# Altium project BC2087.PrjPcb (part 2 of 5)

## Sheet RJ45.SchDoc: =project_title
size Tabloid; CompanyName: Luxonis Holding; DrawnBy: Boris Chou / Blaz Kvas; Organization: Luxonis Holding; Address1: 1925 Harmony Park Drive; Address2: Westminster, CO; Address3: 80234; Address4: United States; DocumentNumber: D2088000; Revision: R3M1E3; SheetNumber: 8; SheetTotal: 12
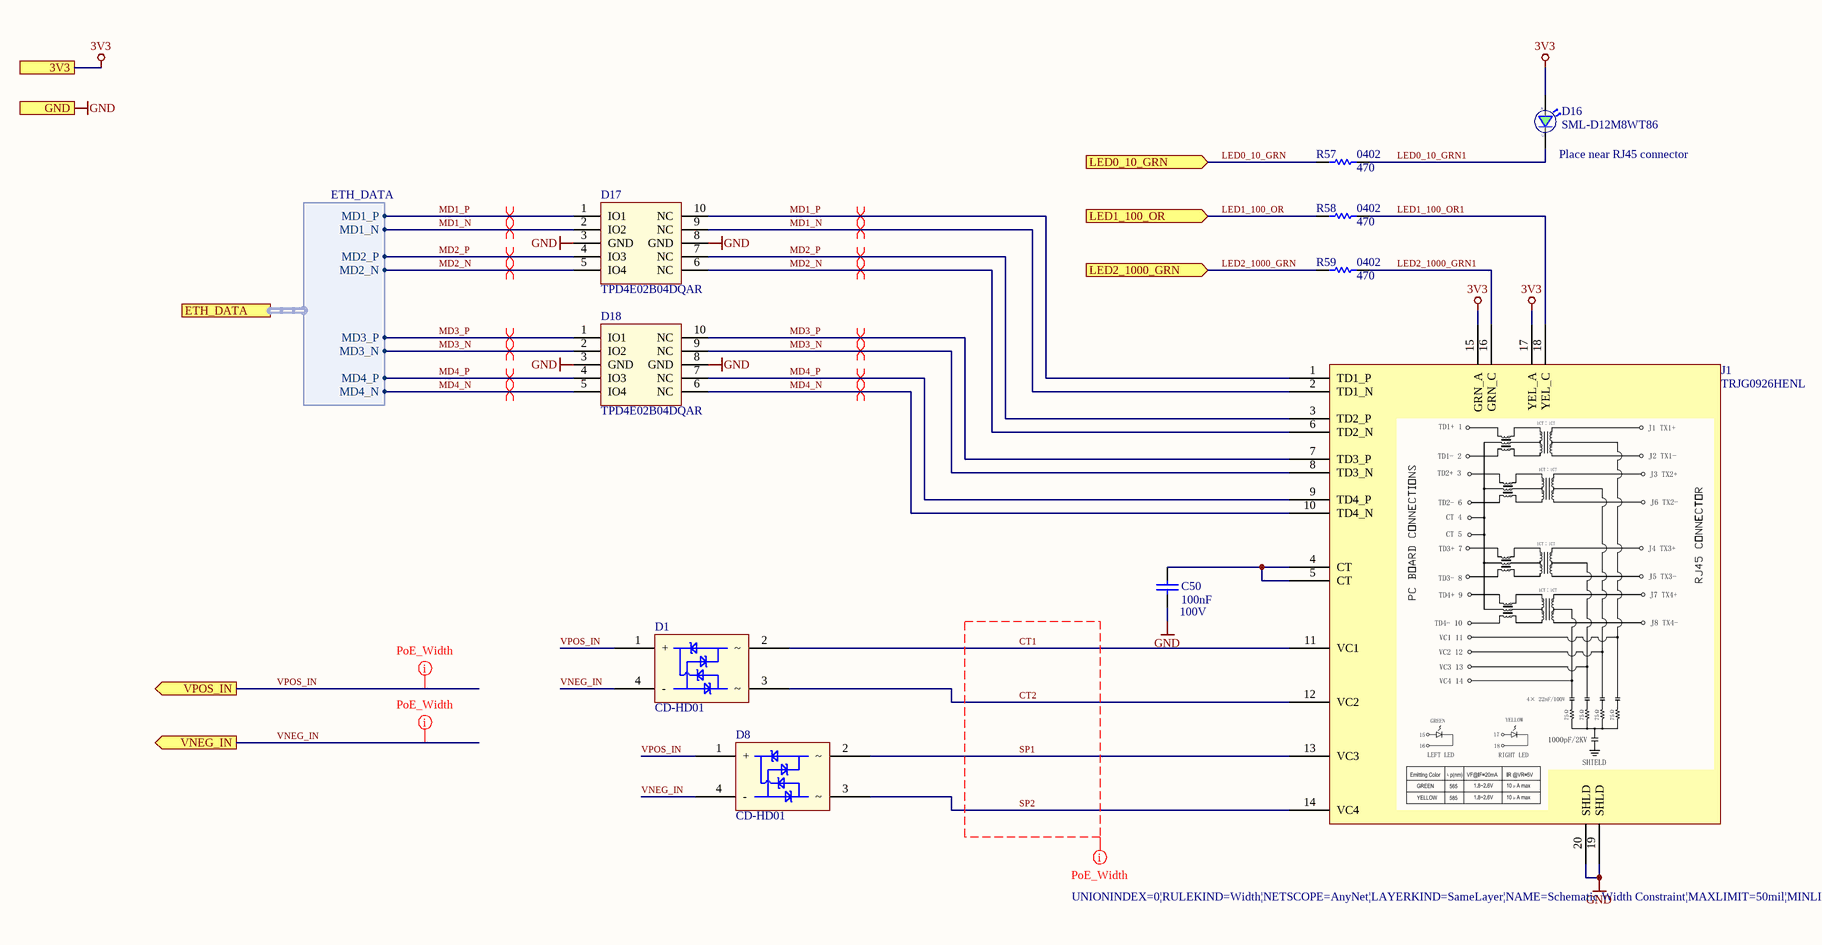
[diagram p5: RJ45.SchDoc]

### Parts
C50  value 100nF  Voltage Rating: 100V  [CAPC0805(2012)145_N]  (hidden comment: CL21B104KCFNNNE)
D1  CD-HD01  [CD-H01]
D8  CD-HD01  [CD-H01]
D16  SML-D12M8WT86  [SML_D1xx8W]
D17  TPD4E02B04DQAR  [TPD4E02B04DQAR]
D18  TPD4E02B04DQAR  [TPD4E02B04DQAR]
J1  TRJG0926HENL  [TRJG0926HENL]
R57  value 470  Case/Package: 0402  [RESC0402(1005)_N]  (hidden comment: CRCW0402470RFKED)
R58  value 470  Case/Package: 0402  [RESC0402(1005)_N]  (hidden comment: CRCW0402470RFKED)
R59  value 470  Case/Package: 0402  [RESC0402(1005)_N]  (hidden comment: CRCW0402470RFKED)

### Ports
3V3, ETH_DATA (harness ETH_DATA), GND, LED0_10_GRN (in), LED1_100_OR (in), LED2_1000_GRN (in), VNEG_IN (out), VPOS_IN (out)

### Harnesses
ETH_DATA: MD1_P, MD1_N, MD2_P, MD2_N, MD3_P, MD3_N, MD4_P, MD4_N

### Nets
3V3: D16.2(A) J1.15(GRN_A) J1.17(YEL_A) ; port 3V3
GND: C50.1 D17.3(GND) D17.8(GND) D18.3(GND) D18.8(GND) J1.19(SHLD) J1.20(SHLD) ; port GND
VNEG_IN: D1.4(-) D8.4(-) ; port VNEG_IN
CT1: D1.2 J1.11(VC1)
CT2: D1.3 J1.12(VC2)
LED0_10_GRN: R57.1 ; port LED0_10_GRN
LED0_10_GRN1: D16.1(C) R57.2
LED1_100_OR: R58.1 ; port LED1_100_OR
LED1_100_OR1: J1.18(YEL_C) R58.2
LED2_1000_GRN: R59.1 ; port LED2_1000_GRN
LED2_1000_GRN1: J1.16(GRN_C) R59.2
MD1_N: D17.2(IO2) D17.9(NC) J1.2(TD1_N) ; port ETH_DATA.MD1_N
MD1_P: D17.1(IO1) D17.10(NC) J1.1(TD1_P) ; port ETH_DATA.MD1_P
MD2_N: D17.5(IO4) D17.6(NC) J1.6(TD2_N) ; port ETH_DATA.MD2_N
MD2_P: D17.4(IO3) D17.7(NC) J1.3(TD2_P) ; port ETH_DATA.MD2_P
MD3_N: D18.2(IO2) D18.9(NC) J1.8(TD3_N) ; port ETH_DATA.MD3_N
MD3_P: D18.1(IO1) D18.10(NC) J1.7(TD3_P) ; port ETH_DATA.MD3_P
MD4_N: D18.5(IO4) D18.6(NC) J1.10(TD4_N) ; port ETH_DATA.MD4_N
MD4_P: D18.4(IO3) D18.7(NC) J1.9(TD4_P) ; port ETH_DATA.MD4_P
SP1: D8.2 J1.13(VC3)
SP2: D8.3 J1.14(VC4)
VPOS_IN: D1.1(+) D8.1(+) ; port VPOS_IN
NetC50_2: C50.2 J1.4(CT) J1.5(CT)

### Layout directives
differential pair; net class ETH; differential pair class 100ohm: MD1_N, MD1_P, MD2_N, MD2_P, MD3_N, MD3_P, MD4_N, MD4_P
rule Width Constraint [Pref Width = 15mil    Min Width = 4mil    Max Width = 50mil]; net class PoE: CT1, CT2, SP1, SP2, VNEG_IN, VPOS_IN

### Notes on the sheet
- (near D16) Place near RJ45 connector
- Title
- Size:
- Date:
- Tabloid
- Number:
- Time:
- Revision:
- Sheet
- of
- Drawn by:

### Library data of the parts
C50 = CMP-108-000003-5: CAP CER 0.1UF 100V X7R 0805 10%; Manufacturer 1: Samsung; Manufacturer Part Number 1: CL21B104KCFNNNE; Case/Package: 0805; Min Operating Temperature: -55°C; Max Operating Temperature: 125°C; Tolerance: 10%; Dielectric: X7R; Length: 2mm; Width: 0.049inch; Depth: 1.25mm; ComponentLink1URL: https://datasheet.ciiva.com/26936/getdatasheetpartid-781823-26936904.pdf?src-supplier=Verical; ComponentLink1Description: https://datasheet.ciiva.com/26936/getdatasheetpartid-781823-26936904.pdf?src-supplier=Verical; Design Item ID: CL21B104KCFNNNE; Mounting Technology: SMT
D1 D8 = CMP-004-00050-1: CD-HD0x Series Schottky Bridge Rectifier Diode 100V 4-Pin Surface Mount T/R; Manufacturer 1: Bourns; Average Rectified Current: 1A; RoHS: No; Stock 1: 15383; Pricing 1: 1=0.61000, 10=0.52500, 100=0.36400, 500=0.28420, 1000=0.23100, 2000=0.21700 (USD); Mount: Surface Mount; Min Operating Temperature: -55°C; Max Operating Temperature: 125°C; Packaging: Tape and Reel; Manufacturer Part Number 1: CD-HD01; Design Item ID: CD-HD01; Source: NG9097_test.SchLib
D16 = CMP-111-000004-2: LED GREEN DIFFUSED 0603 SMD Green 572nm LED Indication - Discrete 2.2V 0603 (1608 Metric); Manufacturer 1: Rohm; Forward Current: 20mA; Color: Green,Yellow; Case/Package: 0603; Min Operating Temperature: -40°C; Max Operating Temperature: 85°C; Forward Voltage: 2.2V; Manufacturer Part Number 1: SML-D12M8WT86
D17 D18 = CMP-111-000006-2: TVS DIODE 3.6V 8.8V 10USON 8.8V (Typ) Clamp 5A (8/20µs) Ipp Tvs Diode Surface Mount 10-USON (2.5x1); Manufacturer 1: Texas Instruments; Number of Bidirectional Channels: 4; Min Breakdown Voltage: 5.5V; Peak Pulse Power: 17W; Power Line Protection: No; Interface: USB,HDMI; Manufacturer Part Number 1: TPD4E02B04DQAR; Stock 1: 25615; Pricing 1: 1=0.69000, 10=0.60800, 100=0.46650, 500=0.36874, 1000=0.29499 (USD); RoHS: Yes; Mount: Surface Mount; Number of Pins: 10; Min Operating Temperature: -40°C; Max Operating Temperature: 125°C; Packaging: Cut Tape; Reverse Standoff Voltage: 3.6V; Clamping Voltage: 8.8V; Operating Supply Voltage: 3.6V; Peak Pulse Current: 5A; Number of Channels: 4; Composition: Zener; REACH SVHC: No SVHC; Lead Free: Lead Free; ComponentLink1URL: http://www.ti.com/general/docs/lit/getliterature.tsp?genericPartNumber=TPD4E02B04&amp;&amp;fileType=pdf&src-supplier=Element14; ComponentLink1Description: http://www.ti.com/general/docs/lit/getliterature.tsp?genericPartNumber=TPD4E02B04&amp;&amp;fileType=pdf&src-supplier=Element14; ComponentLink2URL: http://www.ti.com/lit/ds/symlink/tpd4e02b04.pdf?src-supplier=Farnell; ComponentLink2Description: http://www.ti.com/lit/ds/symlink/tpd4e02b04.pdf?src-supplier=Farnell; ComponentLink3URL: http://www.ti.com/lit/ds/symlink/tpd4e02b04.pdf?src-supplier=Newark; ComponentLink3Description: http://www.ti.com/lit/ds/symlink/tpd4e02b04.pdf?src-supplier=Newark; ComponentLink4URL: http://www.ti.com/lit/ds/symlink/tpd4e02b04.pdf?src-supplier=Digi-Key; ComponentLink4Description: http://www.ti.com/lit/ds/symlink/tpd4e02b04.pdf?src-supplier=Digi-Key; Design Item ID: TPD4E02B04DQAR; Source: BW2098POE_1.SCHLIB
J1 = CMP-109-000002-2: CONN MAGJACK 1PORT 1000 BASET; Manufacturer 1: Trxcom; System: Connector; Manufacturer Part Number 1: TRJG0926HENL; Design Item ID: TRJG0926HENL; Pins: 18; Source: BW2098POE_1.SCHLIB
R57-R59 = CMP-013-000029-9: RES SMD 470 OHM 1% 1/16W 0402; Manufacturer 1: Vishay; Power Rating: 63mW; Voltage Rating: 50V; Manufacturer Part Number 1: CRCW0402470RFKED; Min Operating Temperature: -55°C; Max Operating Temperature: 155°C; Tolerance: 1%; Design Item ID: CRCW0402470RFKED

## Sheet USB.SchDoc: =project_title
size Tabloid; PageSetup: Record=PageOptions|CenterHorizontal=True|CenterVertical=True|PrintScale=0.73|XCorrection=1.00|YCorrection=1.00|PrintKind=0|BorderSize=5000000|LeftOffset=0|BottomOffset=0|Orientation=2|PaperLength=1000|PaperWidth=1000|Scale=100|PaperSource=7|PrintQuality=-4|MediaType=1|DitherType=10|PaperKind=A4|PrintScaleMode=1; CompanyName: Luxonis Holding; DrawnBy: Boris Chou / Blaz Kvas; Organization: Luxonis Holding; Address1: 1925 Harmony Park Drive; Address2: Westminster, CO; Address3: 80234; Address4: United States; DocumentNumber: D2088000; Revision: R3M1E3; SheetNumber: 11; SheetTotal: 12
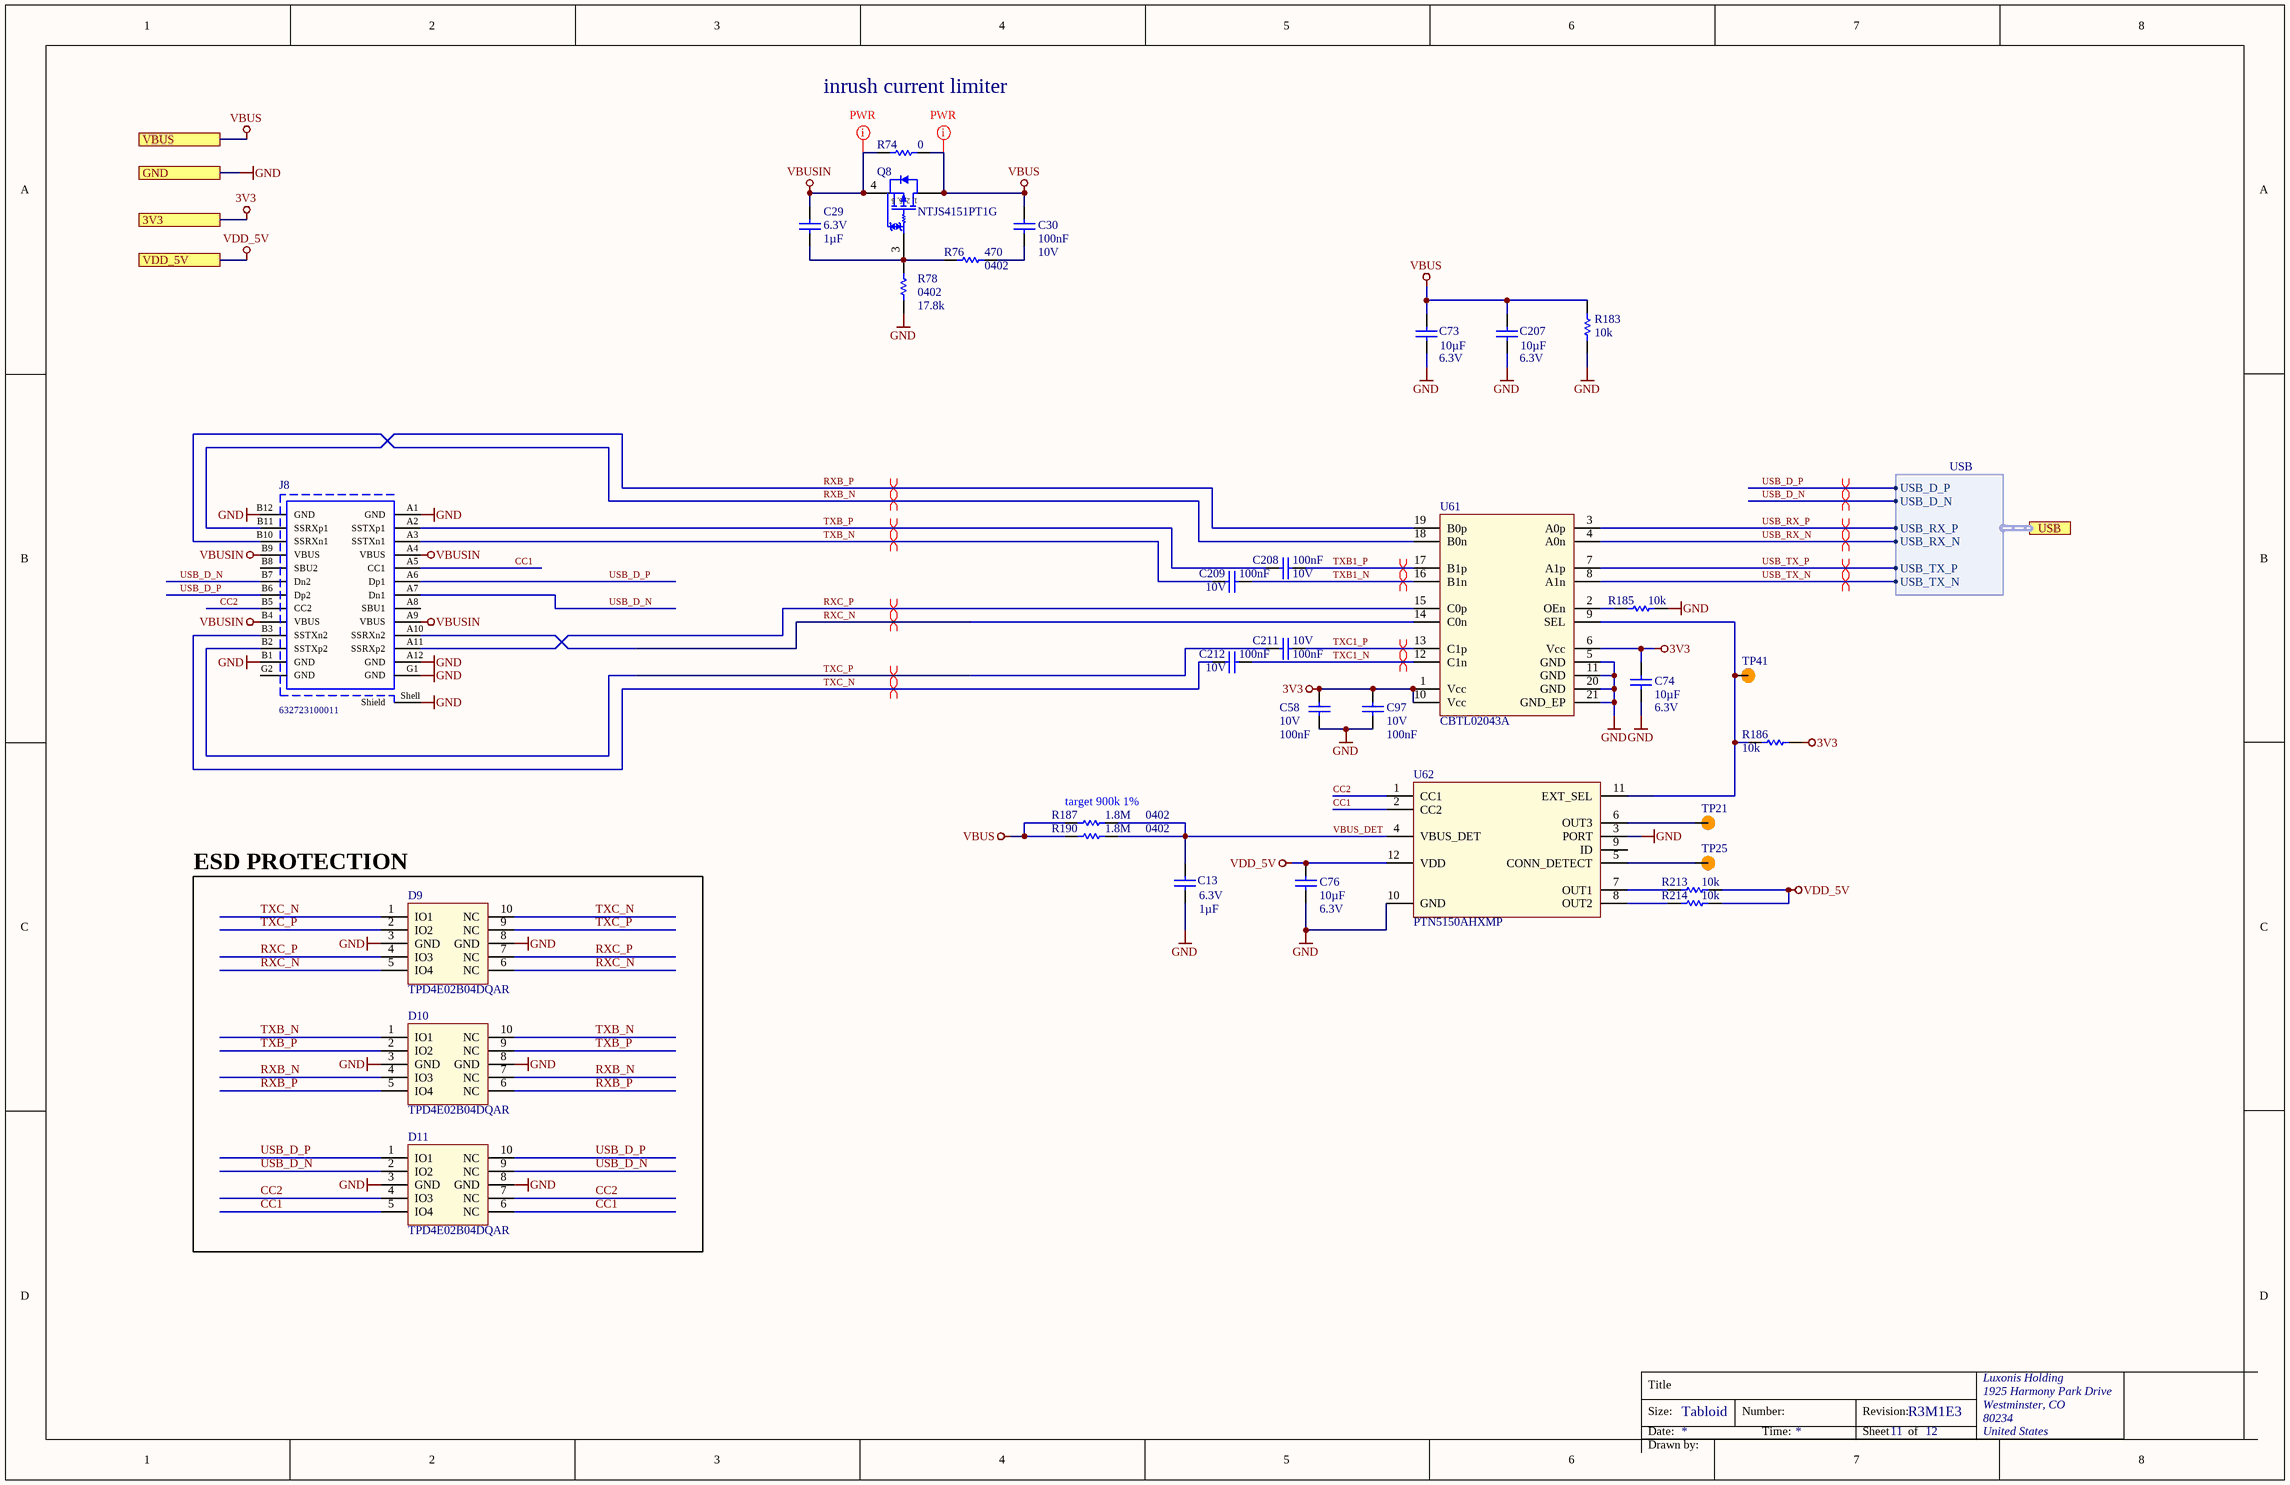
[diagram p6: USB.SchDoc]

### Parts
C13  value 1µF  Voltage Rating: 6.3V  [CAPC0201(0603)33_L]  (hidden comment: GRM033R60J105MEA2D)
C29  value 1µF  Voltage Rating: 6.3V  [CAPC0201(0603)33_L]  (hidden comment: GRM033R60J105MEA2D)
C30  value 100nF  Voltage Rating: 10V  [CAPC0201(0603)33_L]  (hidden comment: GRM033R61A104KE15D)
C58  value 100nF  Voltage Rating: 10V  [CAPC0201(0603)33_L]  (hidden comment: GRM033R61A104KE15D)
C73  value 10µF  Voltage Rating: 6.3V  [CAPC0402(1005)70_N]  (hidden comment: GRM155R60J106ME15D)
C74  value 10µF  Voltage Rating: 6.3V  [CAPC0402(1005)70_N]  (hidden comment: GRM155R60J106ME15D)
C76  value 10µF  Voltage Rating: 6.3V  [CAPC0402(1005)70_N]  (hidden comment: GRM155R60J106ME15D)
C97  value 100nF  Voltage Rating: 10V  [CAPC0201(0603)33_L]  (hidden comment: GRM033R61A104KE15D)
C207  value 10µF  Voltage Rating: 6.3V  [CAPC0402(1005)70_N]  (hidden comment: GRM155R60J106ME15D)
C208  value 100nF  Voltage Rating: 10V  [CAPC0201(0603)33_L]  (hidden comment: GRM033R61A104KE15D)
C209  value 100nF  Voltage Rating: 10V  [CAPC0201(0603)33_L]  (hidden comment: GRM033R61A104KE15D)
C211  value 100nF  Voltage Rating: 10V  [CAPC0201(0603)33_L]  (hidden comment: GRM033R61A104KE15D)
C212  value 100nF  Voltage Rating: 10V  [CAPC0201(0603)33_L]  (hidden comment: GRM033R61A104KE15D)
D9  TPD4E02B04DQAR  [TPD4E02B04DQAR]
D10  TPD4E02B04DQAR  [TPD4E02B04DQAR]
D11  TPD4E02B04DQAR  [TPD4E02B04DQAR]
J8  632723100011  [632723100011]
Q8  NTJS4151PT1G  [ONSC-SC70-6-419B-02_W_V]
R74  value 0  [RESC0603(1608)_L]  (hidden comment: CRCW06030000Z0EA)
R76  value 470  Case/Package: 0402  [RESC0402(1005)_L]  (hidden comment: CRCW0402470RFKED)
R78  value 17.8k  Case/Package: 0402  [RESC0402(1005)_L]  (hidden comment: ERJ-2RKF1782X)
R183  value 10k  [RESC0402(1005)_N]  (hidden comment: RC0402FR-1310KL)
R185  value 10k  [RESC0402(1005)_N]  (hidden comment: RC0402FR-1310KL)
R186  value 10k  [RESC0402(1005)_N]  (hidden comment: RC0402FR-1310KL)
R187  value 1.8M  Case/Package: 0402  [RESC0402(1005)_N]  (hidden comment: CRCW04021M80FKED)
R190  value 1.8M  Case/Package: 0402  [RESC0402(1005)_N]  (hidden comment: CRCW04021M80FKED)
R213  value 10k  [RESC0402(1005)_N]  (hidden comment: RC0402FR-1310KL)
R214  value 10k  [RESC0402(1005)_N]  (hidden comment: RC0402FR-1310KL)
TP21  TEST_POINT  [TP075_150_NS]  (value not drawn)  (no BOM)
TP25  TEST_POINT  [TP075_150_NS]  (value not drawn)  (no BOM)
TP41  TEST_POINT  [TP075_150_NS]  (value not drawn)  (no BOM)
U61  CBTL02043A  [CBTL02043A]
U62  PTN5150AHXMP  [PTN5150H]

### Blocks framed on the sheet
ESD PROTECTION: D9-D11

### Ports
3V3, GND, USB (harness USB), VBUS, VDD_5V

### Harnesses
USB: USB_D_P, USB_D_N, USB_TX_N, USB_TX_P, USB_RX_N, USB_RX_P

### Nets
3V3: C58.2 C74.2 C97.2 R186.2 U61.1(Vcc) U61.6(Vcc) U61.10(Vcc) ; port 3V3
GND: C13.1 C58.1 C73.1 C74.1 C76.1 C97.1 C207.1 D9.3(GND) D9.8(GND) D10.3(GND) D10.8(GND) D11.3(GND) D11.8(GND) J8.A1(GND) J8.A12(GND) J8.B1(GND) J8.B12(GND) J8.G1(GND) J8.Shell(Shield) R78.1 R183.1 R185.2 U61.5(GND) U61.11(GND) U61.20(GND) U61.21(GND_EP) U62.3(PORT) U62.10(GND) ; port GND
VBUS: C30.2 C73.2 C207.2 Q8.1(D) Q8.2(D) Q8.5(D) Q8.6(D) R74.2 R183.2 R187.1 R190.1 ; port VBUS
VBUSIN: C29.2 J8.A4(VBUS) J8.A9(VBUS) J8.B4(VBUS) J8.B9(VBUS) Q8.4(S) R74.1
VDD_5V: C76.2 R213.2 R214.2 U62.12(VDD) ; port VDD_5V
CC1: D11.5(IO4) D11.6(NC) J8.A5(CC1) U62.2(CC2)
CC2: D11.4(IO3) D11.7(NC) J8.B5(CC2) U62.1(CC1)
RXB_N: D10.4(IO3) D10.7(NC) J8.B10(SSRXn1) U61.18(B0n)
RXB_P: D10.5(IO4) D10.6(NC) J8.B11(SSRXp1) U61.19(B0p)
RXC_N: D9.5(IO4) D9.6(NC) J8.A10(SSRXn2) U61.14(C0n)
RXC_P: D9.4(IO3) D9.7(NC) J8.A11(SSRXp2) U61.15(C0p)
TXB1_N: C209.2 U61.16(B1n)
TXB1_P: C208.2 U61.17(B1p)
TXB_N: C209.1 D10.1(IO1) D10.10(NC) J8.A3(SSTXn1)
TXB_P: C208.1 D10.2(IO2) D10.9(NC) J8.A2(SSTXp1)
TXC1_N: C212.2 U61.12(C1n)
TXC1_P: C211.2 U61.13(C1p)
TXC_N: C212.1 D9.1(IO1) D9.10(NC) J8.B3(SSTXn2)
TXC_P: C211.1 D9.2(IO2) D9.9(NC) J8.B2(SSTXp2)
USB_D_N: D11.2(IO2) D11.9(NC) J8.A7(Dn1) J8.B7(Dn2) ; port USB.USB_D_N
USB_D_P: D11.1(IO1) D11.10(NC) J8.A6(Dp1) J8.B6(Dp2) ; port USB.USB_D_P
USB_RX_N: U61.4(A0n) ; port USB.USB_RX_N
USB_RX_P: U61.3(A0p) ; port USB.USB_RX_P
USB_TX_N: U61.8(A1n) ; port USB.USB_TX_N
USB_TX_P: U61.7(A1p) ; port USB.USB_TX_P
VBUS_DET: C13.2 R187.2 R190.2 U62.4(VBUS_DET)
NetC29_1: C29.1 Q8.3(G) R76.1 R78.2
NetC30_1: C30.1 R76.2
NetR185_1: R185.1 U61.2(OEn)
NetR186_1: R186.1 TP41.1 U61.9(SEL) U62.11(EXT_SEL)
NetR213_1: R213.1 U62.7(OUT1)
NetR214_1: R214.1 U62.8(OUT2)
NetTP21_1: TP21.1 U62.6(OUT3)
NetTP25_1: TP25.1 U62.5(CONN_DETECT)

Not connected (* = marked no-connect by the designer): J8 A8(SBU1) B8(SBU2) G2(GND); U62 9(ID)

### Layout directives
differential pair; differential pair class USB3: RXB_N, RXB_P, RXC_N, RXC_P, TXB1_N, TXB1_P, TXB_N, TXB_P, TXC1_N, TXC1_P, TXC_N, TXC_P, USB_D_N, USB_D_P, USB_RX_N, USB_RX_P, USB_TX_N, USB_TX_P
net class Power_trace: VBUS, VBUSIN

### Notes on the sheet
- inrush current limiter
- (near R187) target 900k 1%
- Title
- Size:
- Date:
- Tabloid
- Number:
- Time:
- Revision:
- Sheet
- of
- Drawn by:
- (in symbol CMP-061-000004-2) 1, 2, 5, 6

### Library data of the parts
C13 C29 = CMP-004-000006-5: CAP CER 1UF 6.3V X5R 0201 20%; Manufacturer 1: Murata; Manufacturer Part Number 1: GRM033R60J105MEA2D; Case/Package: 0201; Min Operating Temperature: -55°C; Max Operating Temperature: 85°C; Tolerance: 20%; Dielectric: X5R; Length: 0.6mm; Height: 0.3mm; Width: 0.3mm; Depth: 0.3mm; ComponentLink1URL: https://datasheet.ciiva.com/18699/grm033r60j105mea2-02-18699520.pdf?src-supplier=Digi-Key; ComponentLink1Description: https://datasheet.ciiva.com/18699/grm033r60j105mea2-02-18699520.pdf?src-supplier=Digi-Key; ComponentLink2URL: https://datasheet.ciiva.com/24218/c02e-24218376.pdf?src-supplier=Mouser; ComponentLink2Description: https://datasheet.ciiva.com/24218/c02e-24218376.pdf?src-supplier=Mouser; ComponentLink3URL: https://datasheet.ciiva.com/18699/partnumbering-e-01-18699519.pdf?src-supplier=Digi-Key; ComponentLink3Description: https://datasheet.ciiva.com/18699/partnumbering-e-01-18699519.pdf?src-supplier=Digi-Key; Design Item ID: GRM033R60J105MEA2D; Mounting Technology: SMT
C30 C58 C97 C208 C209 C211 C212 = CMP-004-000007-6: CAP CER 0.1UF 10V X5R 0201 10%; Manufacturer 1: Murata; Manufacturer Part Number 1: GRM033R61A104KE15D; Case/Package: 0201; Min Operating Temperature: -55°C; Max Operating Temperature: 85°C; Tolerance: 10%; Dielectric: X5R; Length: 0.6mm; Height: 0.3mm; Width: 0.012inch; Depth: 0.3mm; ComponentLink1URL: https://datasheet.ciiva.com/26843/getdatasheetpartid-308656-26843739.pdf?src-supplier=Verical; ComponentLink1Description: https://datasheet.ciiva.com/26843/getdatasheetpartid-308656-26843739.pdf?src-supplier=Verical; ComponentLink2URL: https://datasheet.ciiva.com/5413/product-5413117.pdf?src-supplier=Mouser; ComponentLink2Description: https://datasheet.ciiva.com/5413/product-5413117.pdf?src-supplier=Mouser; ComponentLink3URL: https://datasheet.ciiva.com/6256/partnumbering-e-01-6256406.pdf?src-supplier=Digi-Key; ComponentLink3Description: https://datasheet.ciiva.com/6256/partnumbering-e-01-6256406.pdf?src-supplier=Digi-Key; ComponentLink4URL: https://datasheet.ciiva.com/6256/partnumbering-e-01-6256407.pdf?src-supplier=Digi-Key; ComponentLink4Description: https://datasheet.ciiva.com/6256/partnumbering-e-01-6256407.pdf?src-supplier=Digi-Key; ComponentLink5URL: https://datasheet.ciiva.com/6256/partnumbering-e-01-6256408.pdf?src-supplier=Digi-Key; ComponentLink5Description: https://datasheet.ciiva.com/6256/partnumbering-e-01-6256408.pdf?src-supplier=Digi-Key; Design Item ID: GRM033R61A104KE15D; Mounting Technology: SMT
C73 C74 C76 C207 = CMP-004-000009-5: CAP CER 10UF 6.3V X5R 0402 20%; Manufacturer 1: Murata; Manufacturer Part Number 1: GRM155R60J106ME15D; Case/Package: 0402; Min Operating Temperature: -55°C; Max Operating Temperature: 85°C; Dielectric: X5R; Length: 0.039inch; Width: 0.02inch; ComponentLink1URL: https://www.murata.com/~/media/webrenewal/support/library/catalog/products/capacitor/mlcc/c02e.ashx?la=en-us&src-supplier=Digi-Key; ComponentLink1Description: https://www.murata.com/~/media/webrenewal/support/library/catalog/products/capacitor/mlcc/c02e.ashx?la=en-us&src-supplier=Digi-Key; Tolerance: 20%; Design Item ID: GRM155R60J106ME15D; Mounting Technology: SMT
D9-D11 = CMP-111-000006-2: as D17 on sheet RJ45; Manufacturer Part Number 1: TPD4E02B04DQAR; Stock 1: 25615; Pricing 1: 1=0.69000, 10=0.60800, 100=0.46650, 500=0.36874, 1000=0.29499 (USD); RoHS: Yes; Mount: Surface Mount; Number of Pins: 10; Min Operating Temperature: -40°C; Max Operating Temperature: 125°C; Packaging: Cut Tape; Reverse Standoff Voltage: 3.6V; Clamping Voltage: 8.8V; Operating Supply Voltage: 3.6V; Peak Pulse Current: 5A; Number of Channels: 4; Composition: Zener; REACH SVHC: No SVHC; Lead Free: Lead Free; ComponentLink1URL: http://www.ti.com/general/docs/lit/getliterature.tsp?genericPartNumber=TPD4E02B04&amp;&amp;fileType=pdf&src-supplier=Element14; ComponentLink1Description: http://www.ti.com/general/docs/lit/getliterature.tsp?genericPartNumber=TPD4E02B04&amp;&amp;fileType=pdf&src-supplier=Element14; ComponentLink2URL: http://www.ti.com/lit/ds/symlink/tpd4e02b04.pdf?src-supplier=Farnell; ComponentLink2Description: http://www.ti.com/lit/ds/symlink/tpd4e02b04.pdf?src-supplier=Farnell; ComponentLink3URL: http://www.ti.com/lit/ds/symlink/tpd4e02b04.pdf?src-supplier=Newark; ComponentLink3Description: http://www.ti.com/lit/ds/symlink/tpd4e02b04.pdf?src-supplier=Newark; ComponentLink4URL: http://www.ti.com/lit/ds/symlink/tpd4e02b04.pdf?src-supplier=Digi-Key; ComponentLink4Description: http://www.ti.com/lit/ds/symlink/tpd4e02b04.pdf?src-supplier=Digi-Key; Design Item ID: TPD4E02B04DQAR; Source: BW2098POE_1.SCHLIB
J8 = CMP-002-00096-2: USB C 3.1 Connector, 24 Contact(s), Female, Right Angle, Solder and Surface Mount Terminal, Receptacle; Manufacturer 1: Wurth Electronics; Connector Type: TELECOM AND DATACOM CONNECTOR; RoHS Compliant: Yes; Supplier Part Number 1: 732-9617-2-ND; Manufacturer Part Number 1: 632723100011; Gender: Female; Pins: 24; Supplier 1: Digikey
Q8 = CMP-061-000004-2: Trench Power MOSFET, -20 V, -4.2 A, Single P-Channel, 6-Pin SC70, Pb-Free, Tape and Reel; Manufacturer 1: ON Semiconductor; PD Max (W): 1; Continuous Drain Current: 4.2A; Transistor Type: P Channel; Mounting Technology: Surface Mount; PartNumber: NTJS4151PT1G; Manufacturer Part Number 1: NTJS4151PT1G; Design Item ID: NTJS4151PT1G
R74 = CMP-115-000011-7: RES SMD 0 OHM 5% 1/10W 0603; Manufacturer 1: Vishay; Manufacturer Part Number 1: CRCW0603-0000Z0EA; Power Rating: 100mW; Voltage Rating: 75V; Temperature Coefficient: 100ppm/°C; Case/Package: 0603; Min Operating Temperature: -55°C; Max Operating Temperature: 155°C; Tolerance: 5%; Design Item ID: CRCW06030000Z0EA
R76 = CMP-013-000029-9: as R57 on sheet RJ45; Manufacturer Part Number 1: CRCW0402470RFKED; Min Operating Temperature: -55°C; Max Operating Temperature: 155°C; Tolerance: 1%; Design Item ID: CRCW0402470RFKED
R78 = CMP-013-000001-9: RES SMD 17.8K OHM 1% 1/10W 0402; Manufacturer 1: Panasonic; Power Rating: 100mW; Voltage Rating: 50V; Min Operating Temperature: -55°C; Max Operating Temperature: 155°C; Manufacturer Part Number 1: ERJ-2RKF1782X; Tolerance: 1%; Design Item ID: ERJ-2RKF1782X
R183 R185 R186 = CMP-115-000004-8: RES SMD 10K OHM 1% 1/16W 0402; Manufacturer 1: Yageo; Temperature Coefficient: 100ppm/°C; Power Rating: 62.5mW; Voltage Rating: 50V; Manufacturer Part Number 1: RC0402FR-1310KL; Case/Package: 0402; Min Operating Temperature: -55°C; Max Operating Temperature: 155°C; Tolerance: 1%; Design Item ID: RC0402FR-1310KL
R187 R190 = CMP-013-000023-8: RES SMD 1.8M OHM 1% 1/16W 0402; Manufacturer 1: Vishay; Voltage Rating: 50V; Power Rating: 63mW; Manufacturer Part Number 1: CRCW04021M80FKED; Min Operating Temperature: -55°C; Max Operating Temperature: 155°C; Tolerance: 1%; Design Item ID: CRCW04021M80FKED
R213 R214 = CMP-115-000004-8: RES SMD 10K OHM 1% 1/16W 0402; Manufacturer 1: Yageo; Voltage Rating: 50V; Power Rating: 62.5mW; Temperature Coefficient: 100ppm/°C; Tolerance: 1%; Max Operating Temperature: 155°C; Case/Package: 0402; Design Item ID: RC0402FR-1310KL; Min Operating Temperature: -55°C; Manufacturer Part Number 1: RC0402FR-1310KL
TP21 TP25 TP41 = CMP-015-000000-2: Manufacturer Part Number 1: /; Design Item ID: TEST_POINT; Source: LuxonisMaster.SchLib
U61 = CMP-045-000000-2: Multiplexer And Demux/Decoder, CBT/FST/QS/5C/B Series, 1-Func, 2 Line Input, 1 Line Output, True Output, PQCC20; Manufacturer Part Number 1: CBTL02043ABQ,115; Manufacturer 1: NXP Semiconductors
U62 = CMP-044-000000-3: Power Supply Support Circuit, Fixed, 2 Channel, 0.2, PQCC12; Manufacturer Part Number 1: PTN5150HXMP; Manufacturer 1: NXP Semiconductors

## Sheet BOOT_JTAG_AUX.SchDoc: =project_title
size Tabloid; CompanyName: Luxonis Holding; DrawnBy: Boris Chou / Blaz Kvas; Organization: Luxonis Holding; Address1: 1925 Harmony Park Drive; Address2: Westminster, CO; Address3: 80234; Address4: United States; DocumentNumber: D2088000; Revision: R3M1E3; SheetNumber: 9; SheetTotal: 12
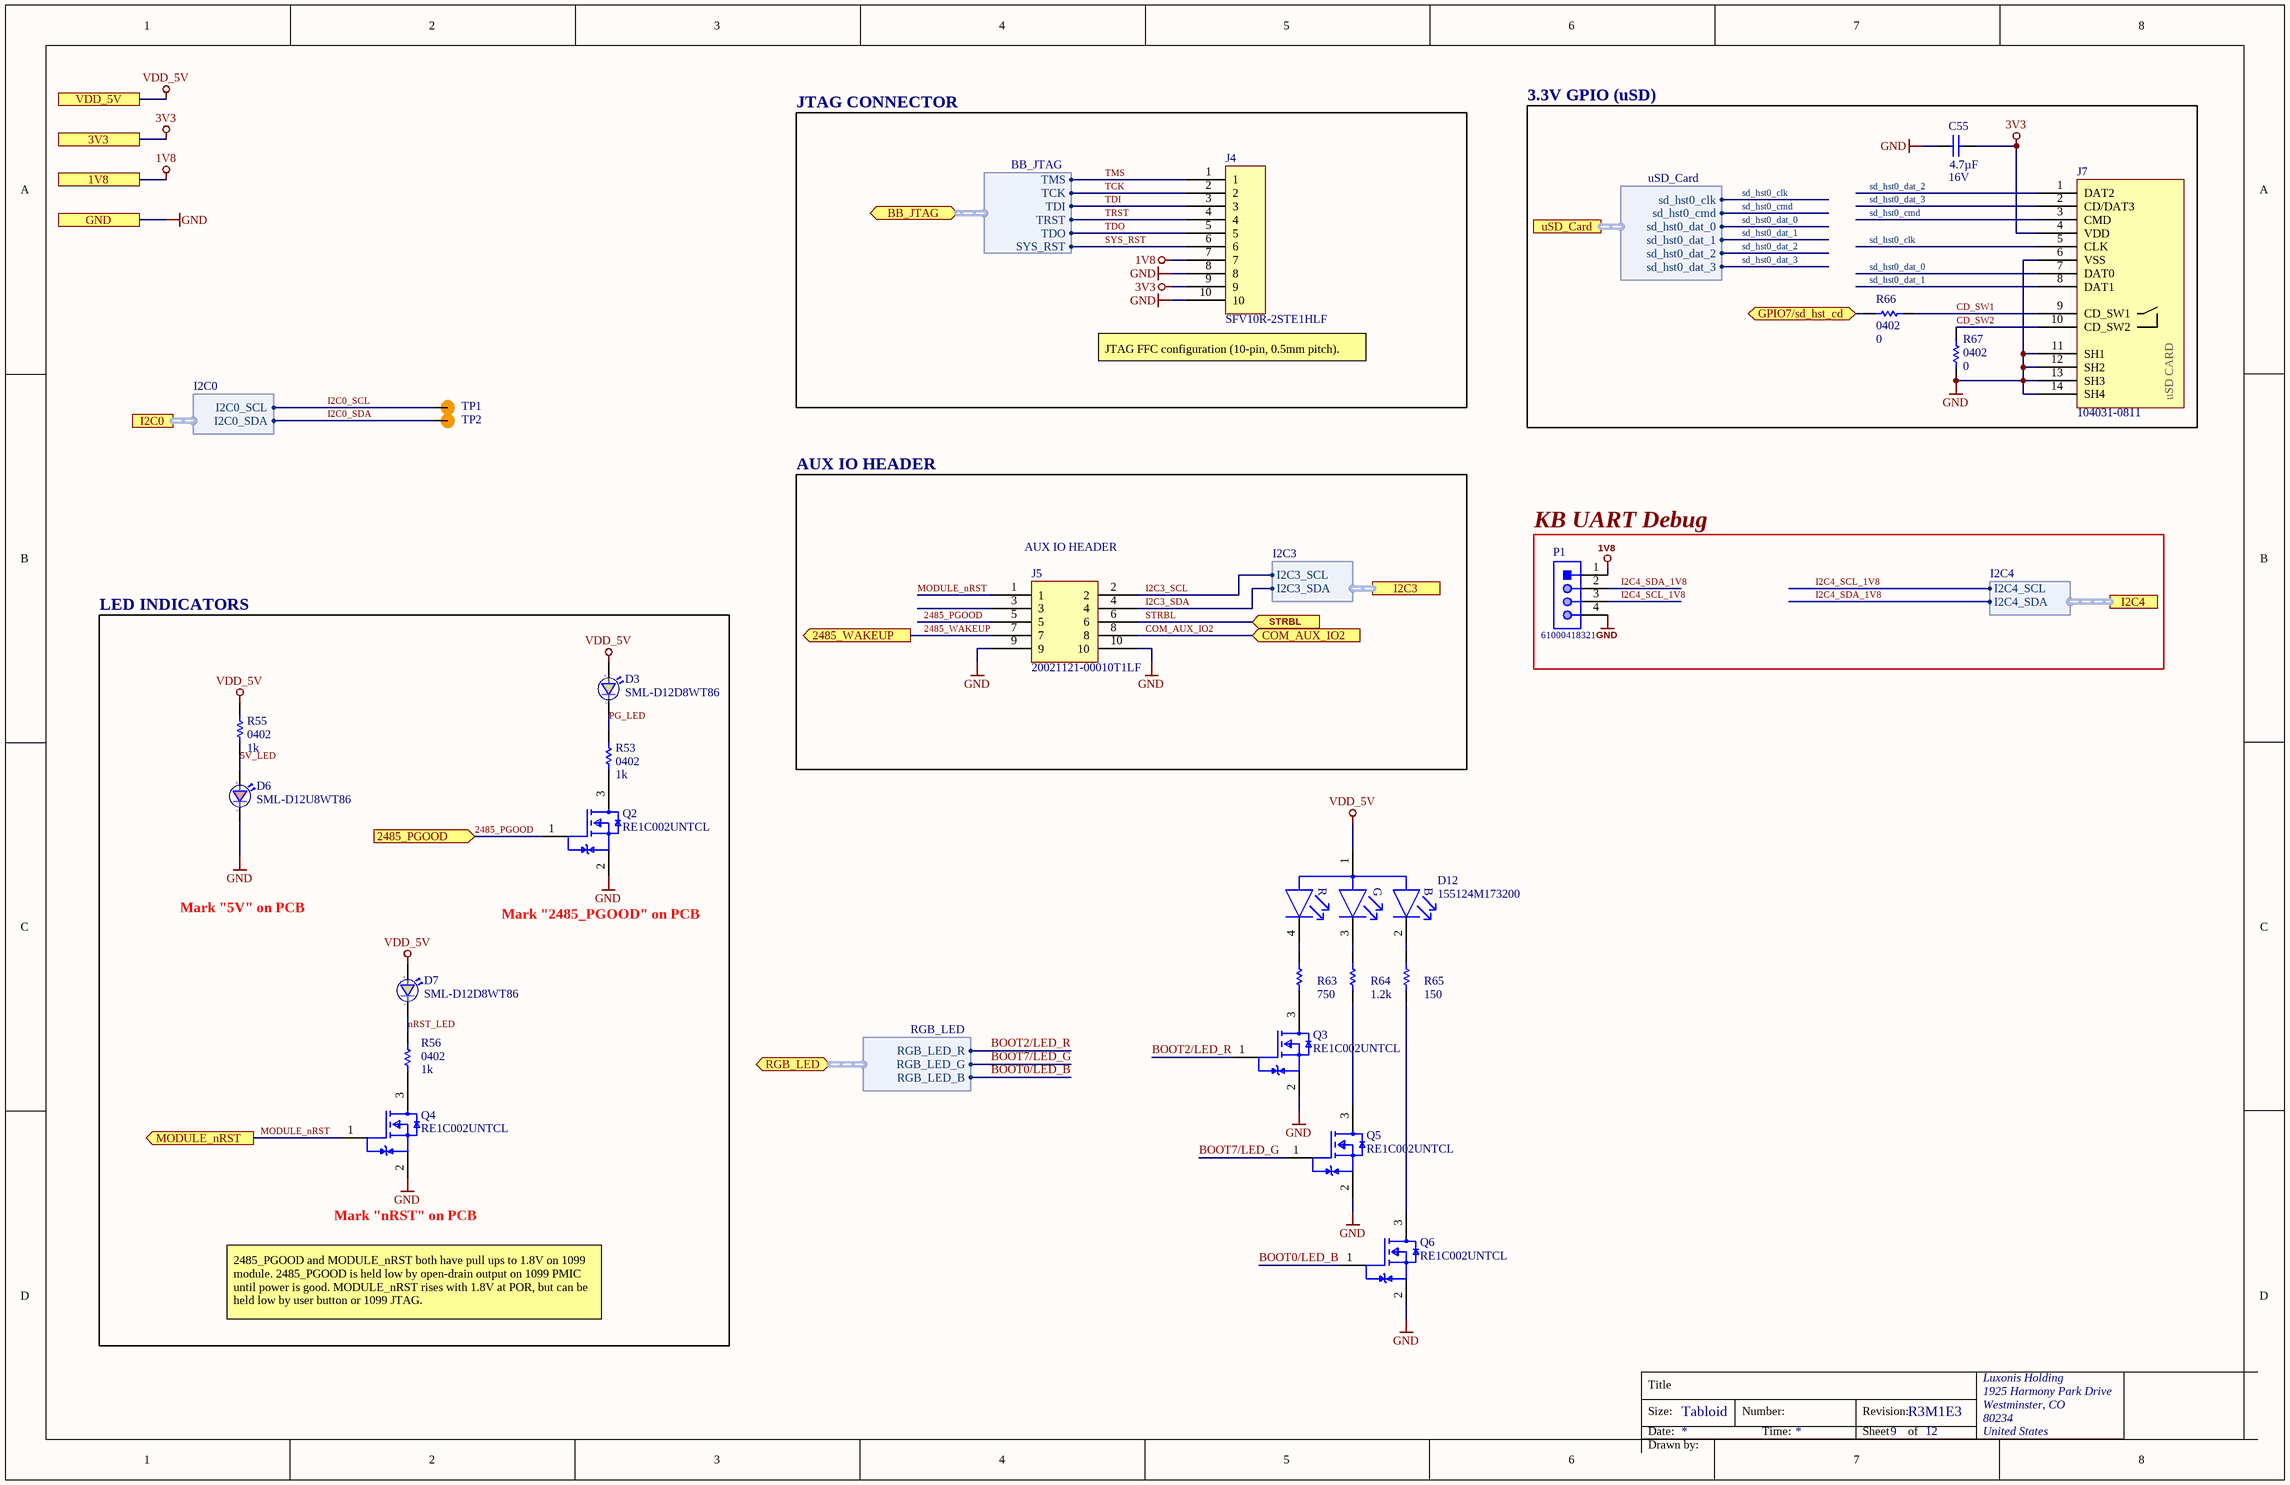
[diagram p7: BOOT_JTAG_AUX.SchDoc]

### Parts
C55  value 4.7µF  Voltage Rating: 16V  [CAPC0603(1608)100_N]  (hidden comment: GRM188R61C475KAAJD)
D3  SML-D12D8WT86  [SML_D1xx8W]
D6  SML-D12U8WT86  [SML_D1xx8W]
D7  SML-D12D8WT86  [SML_D1xx8W]
D12  155124M173200  [FP-155124M173200-MFG]
J4  SFV10R-2STE1HLF  [SFV10R-2STE1HLF]
J5  20021121-00010T1LF  [20021121-00010T1LF]
J7  104031-0811  [104031-0811]
P1  61000418321  [61000418321]
Q2  RE1C002UNTCL  [RE1C002UNTCL]
Q3  RE1C002UNTCL  [RE1C002UNTCL]
Q4  RE1C002UNTCL  [RE1C002UNTCL]
Q5  RE1C002UNTCL  [RE1C002UNTCL]
Q6  RE1C002UNTCL  [RE1C002UNTCL]
R53  value 1k  Case/Package: 0402  [RESC0402(1005)_N]  (hidden comment: RC0402FR-071KL)
R55  value 1k  Case/Package: 0402  [RESC0402(1005)_N]  (hidden comment: RC0402FR-071KL)
R56  value 1k  Case/Package: 0402  [RESC0402(1005)_N]  (hidden comment: RC0402FR-071KL)
R63  value 750  [RESC1005X40X25NL05T05]  (hidden comment: ERJ-2RKF7500X)
R64  value 1.2k  [RESC1005X40X25NL05T05]  (hidden comment: CRCW04021K20FKED)
R65  value 150  [RESC1005X40X25NL05T10]  (hidden comment: RC0402FR-07150RL)
R66  value 0  Case/Package: 0402  [RESC0402(1005)_N]  (hidden comment: CRCW04020000Z0ED)
R67  value 0  Case/Package: 0402  [RESC0402(1005)_N]  (hidden comment: CRCW04020000Z0ED)
TP1  TEST_POINT  [TP100_200_NS]  (value not drawn)  (no BOM)
TP2  TEST_POINT  [TP100_200_NS]  (value not drawn)  (no BOM)

### Blocks framed on the sheet
JTAG CONNECTOR: J4
3.3V GPIO (uSD): C55 J7 R66 R67
AUX IO HEADER: J5
KB UART Debug: P1
LED INDICATORS: D3 D6 D7 Q2 Q4 R53 R55 R56

### Ports
1V8, 3V3, 2485_PGOOD (in), 2485_WAKEUP (out), BB_JTAG (bidir, harness BB_JTAG), COM_AUX_IO2 (in), GND, GPIO7/sd_hst_cd (bidir), I2C0 (harness I2C0), I2C3 (harness I2C3), I2C4 (harness I2C4), MODULE_nRST (out), RGB_LED (bidir, harness RGB_LED), STRBL (in), uSD_Card (harness uSD_Card), VDD_5V

### Harnesses
BB_JTAG: TMS, TCK, TDI, TRST, TDO, SYS_RST
I2C3: I2C3_SDA, I2C3_SCL
uSD_Card: sd_hst0_clk, sd_hst0_cmd, sd_hst0_dat_0, sd_hst0_dat_1, sd_hst0_dat_2, sd_hst0_dat_3
I2C0: I2C0_SDA, I2C0_SCL
RGB_LED: RGB_LED_G, RGB_LED_B, RGB_LED_R
I2C4: I2C4_SDA, I2C4_SCL

### Nets
1V8: J4.7 P1.1 ; port 1V8
3V3: C55.2 J4.9 J7.4(VDD) ; port 3V3
GND: C55.1 D6.1(C) J4.8 J4.10 J5.9 J5.10 J7.6(VSS) J7.11(SH1) J7.12(SH2) J7.13(SH3) J7.14(SH4) P1.4 Q2.2(Source) Q3.2(Source) Q4.2(Source) Q5.2(Source) Q6.2(Source) R67.1 ; port GND
VDD_5V: D3.2(A) D7.2(A) D12.1(COMMON_ANODE) R55.2 ; port VDD_5V
5V_LED: D6.2(A) R55.1
2485_PGOOD: J5.5 Q2.1(Gate) ; port 2485_PGOOD
2485_WAKEUP: J5.7 ; port 2485_WAKEUP
BOOT0/LED_B: Q6.1(Gate) ; port RGB_LED.RGB_LED_B
BOOT2/LED_R: Q3.1(Gate) ; port RGB_LED.RGB_LED_R
BOOT7/LED_G: Q5.1(Gate) ; port RGB_LED.RGB_LED_G
CD_SW1: J7.9(CD_SW1) R66.1
CD_SW2: J7.10(CD_SW2) R67.2
COM_AUX_IO2: J5.8 ; port COM_AUX_IO2
GPIO7/sd_hst_cd: R66.2 ; port GPIO7/sd_hst_cd
I2C0_SCL: TP1.1 ; port I2C0.I2C0_SCL
I2C0_SDA: TP2.1 ; port I2C0.I2C0_SDA
I2C3_SCL: J5.2 ; port I2C3.I2C3_SCL
I2C3_SDA: J5.4 ; port I2C3.I2C3_SDA
I2C4_SCL_1V8: P1.3 ; port I2C4.I2C4_SCL
I2C4_SDA_1V8: P1.2 ; port I2C4.I2C4_SDA
MODULE_nRST: J5.1 Q4.1(Gate) ; port MODULE_nRST
nRST_LED: D7.1(C) R56.2
PG_LED: D3.1(C) R53.2
sd_hst0_clk: J7.5(CLK) ; port uSD_Card.sd_hst0_clk
sd_hst0_cmd: J7.3(CMD) ; port uSD_Card.sd_hst0_cmd
sd_hst0_dat_0: J7.7(DAT0) ; port uSD_Card.sd_hst0_dat_0
sd_hst0_dat_1: J7.8(DAT1) ; port uSD_Card.sd_hst0_dat_1
sd_hst0_dat_2: J7.1(DAT2) ; port uSD_Card.sd_hst0_dat_2
sd_hst0_dat_3: J7.2(CD/DAT3) ; port uSD_Card.sd_hst0_dat_3
STRBL: J5.6 ; port STRBL
SYS_RST: J4.6 ; port BB_JTAG.SYS_RST
TCK: J4.2 ; port BB_JTAG.TCK
TDI: J4.3 ; port BB_JTAG.TDI
TDO: J4.5 ; port BB_JTAG.TDO
TMS: J4.1 ; port BB_JTAG.TMS
TRST: J4.4 ; port BB_JTAG.TRST
NetD12_2: D12.2(BLUE_C) R65.2
NetD12_3: D12.3(GREEN_C) R64.2
NetD12_4: D12.4(RED_C) R63.2
NetQ2_3: Q2.3(Drain) R53.1
NetQ3_3: Q3.3(Drain) R63.1
NetQ4_3: Q4.3(Drain) R56.1
NetQ5_3: Q5.3(Drain) R64.1
NetQ6_3: Q6.3(Drain) R65.1

Not connected (* = marked no-connect by the designer): J5 3

### Notes on the sheet
- (near J4) JTAG FFC configuration (10-pin, 0.5mm pitch).
- (near J5) AUX IO HEADER
- Mark "5V" on PCB
- Mark "2485_PGOOD" on PCB
- Mark "nRST" on PCB
- 2485_PGOOD and MODULE_nRST both have pull ups to 1.8V on 1099 module. 2485_PGOOD is held low by open-drain output on 1099 PMIC until power is good. MODULE_nRST rises with 1.8V at POR, but can be held low by user button or 1099 JTAG.
- Title
- Size:
- Date:
- Tabloid
- Number:
- Time:
- Revision:
- Sheet
- of
- Drawn by:
- (in symbol CMP-005-000008-2) uSD CARD
- (in symbol CMP-007-00038-2) R; G; B

### Library data of the parts
C55 = CMP-004-000020-4: CAP CER 4.7UF 16V X5R 0603 10%; Manufacturer 1: Murata; Manufacturer Part Number 1: GRM188R61C475KAAJD; Case/Package: 0603; Min Operating Temperature: -55°C; Max Operating Temperature: 85°C; Tolerance: 10%; Dielectric: X5R; Length: 1.6mm; Height: 0.8mm; Width: 0.8mm; Depth: 0.8mm; ComponentLink1URL: https://datasheet.ciiva.com/14813/595grm188r61c475kaaj23-14813668.pdf?src-supplier=Arrow; ComponentLink1Description: https://datasheet.ciiva.com/14813/595grm188r61c475kaaj23-14813668.pdf?src-supplier=Arrow; Manufacturer 2: Murata; Manufacturer Part Number 2: GRM188R61C475KAAJD; Manufacturer 3: Murata; Manufacturer Part Number 3: GRM188R61C475KAAJD; Design Item ID: GRM188R61C475KAAJD; Mounting Technology: SMT
D3 D7 = CMP-111-000003-2: LED ORANGE DIFFUSED 0603 SMD Orange 605nm LED Indication - Discrete 2.2V 0603 (1608 Metric); Manufacturer 1: Rohm; Forward Current: 20mA; Case/Package: 0603; Color: Orange; Min Operating Temperature: -40°C; Max Operating Temperature: 85°C; Forward Voltage: 2.2V; Manufacturer Part Number 1: SML-D12D8WT86
D6 = CMP-111-000005-2: LED RED DIFFUSED 0603 SMD Red 620nm LED Indication - Discrete 2.2V 0603 (1608 Metric); Manufacturer 1: Rohm; Forward Current: 20mA; Case/Package: 0603; Color: Red; Min Operating Temperature: -40°C; Max Operating Temperature: 85°C; Forward Voltage: 2.2V; Manufacturer Part Number 1: SML-D12U8WT86
D12 = CMP-007-00038-2: Triple Color LED; Manufacturer 1: Wurth Elektronik; Max Current Rating: 30mA; Viewing Angle: 120°; Colour: RGB; Forward Current: 20mA; Case/Package: 1204; Manufacturer Part Number 1: 155124M173200
J4 = CMP-005-000024-3: CONN FFC TOP 10POS 0.50MM R/A; Manufacturer 1: Amphenol FCI; Voltage Rating: 50V; Gender: Female; Pitch: 0.5mm; Manufacturer Part Number 1: SFV10R-2STE1HLF; Mount: Surface Mount; Min Operating Temperature: -55°C; Max Operating Temperature: 105°C; Orientation: Right Angle; Pins: 10
J5 = CMP-005-000031-2: CONN HEADER SMD 10POS 1.27MM; Manufacturer 1: Amphenol FCI; Number of Contacts: 10; Contact Resistance: 30mR; Max Voltage Rating (AC): 125V; Connector Type: Male Pin; Row Spacing: 0.05inch; Manufacturer Part Number 1: 20021121-00010T1LF; Stock 1: 1465; Pricing 1: 1=0.77000, 10=0.71800, 100=0.55040, 500=0.47860, 1000=0.39485, 5000=0.34699, 10000=0.32306 (USD); RoHS: Yes; Mount: Surface Mount; Contact Plating: Gold; Color: Black; Contact Material: Copper Alloy; Housing Color: Black; Housing Material: Thermoplastic; Min Operating Temperature: -40°C; Max Operating Temperature: 85°C; Number of Rows: 2; Termination: Solder; Package Quantity: 93; Packaging: Rail/Tube; Number of Positions: 10; Orientation: Straight; Length: 6.35mm; Pitch: 1.27mm; Contact Mating Length: 0.12inch; Depth: 3.4mm; ComponentLink1URL: https://datasheet.ciiva.com/18659/20021121-18659066.pdf?src-supplier=Digi-Key; ComponentLink1Description: https://datasheet.ciiva.com/18659/20021121-18659066.pdf?src-supplier=Digi-Key; ComponentLink2URL: https://datasheet.ciiva.com/10033/20021121-10033582.pdf?src-supplier=Avnet; ComponentLink2Description: https://datasheet.ciiva.com/10033/20021121-10033582.pdf?src-supplier=Avnet; Design Item ID: 20021121-00010T1LF; Pins: 10; Source: LuxonisMaster.SchLib
J7 = CMP-005-000008-2: CONN MICRO SD CARD PUSH-PULL R/A; Manufacturer 1: Molex; Manufacturer Part Number 1: 104031-0811; Pins: 9
P1 = CMP-002-00148-1: Terminal and Terminal Block; Manufacturer 1: Wurth Elektronik; Connector Type: BOARD CONNECTOR; Pins: 4; Min Operating Temperature: -40°C; Manufacturer Part Number 1: 61000418321; Mounting Technology: Board; Max Operating Temperature: 125°C
Q2-Q6 = CMP-120-000001-2: MOSFET N-CH 20V 0.2A EMT3; Manufacturer 1: Rohm; Continuous Drain Current: 200mA; Case/Package: SOT-89; Manufacturer Part Number 1: RE1C002UNTCL; Design Item ID: RE1C002UNTCL; Max Drain to Source Voltage: 20V
R53 R55 R56 = CMP-013-000004-10: RES SMD 1K OHM 1% 1/16W 0402; Manufacturer 1: Yageo; Power Rating: 62.5mW; Voltage Rating: 50V; Min Operating Temperature: -55°C; Max Operating Temperature: 155°C; Manufacturer Part Number 1: RC0402FR-071KL; Tolerance: 1%; Design Item ID: RC0402FR-071KL
R63 = CMP-009-00197-7: RES SMD 750 OHM 1% 0.1W 0402; Manufacturer 1: Panasonic; Power Rating: 100mW; Manufacturer Part Number 1: ERJ-2RKF7500X; Case/Package: 0402; Tolerance: 1%
R64 = CMP-009-00198-14: RES SMD 1.2K OHM 1% 0.063W 0402; Manufacturer 1: Vishay; Voltage Rating: 50V; Power Rating: 63mW; Case/Package: 0402; Manufacturer Part Number 1: CRCW04021K20FKED; Tolerance: 1%
R65 = CMP-009-00196-7: RES SMD 150 OHM 1% 1/16W 0402; Manufacturer 1: Yageo; Voltage Rating: 50V; Case/Package: 0402; Tolerance: 1%; Manufacturer Part Number 1: RC0402FR-07150RL
R66 R67 = CMP-013-000022-11: RES SMD 0 OHM 5% 1/16W 0402; Manufacturer 1: Vishay; Power Rating: 63mW; Voltage Rating: 50V; Manufacturer Part Number 1: CRCW04020000Z0ED; Min Operating Temperature: -55°C; Max Operating Temperature: 155°C; Tolerance: 5%; Design Item ID: CRCW04020000Z0ED
TP1 TP2 = CMP-015-000000-2: Manufacturer Part Number 1: /; Design Item ID: TEST_POINT; Source: LuxonisMaster.SchLib